# Altium schematic sheet Sheet2.SchDoc
size A4
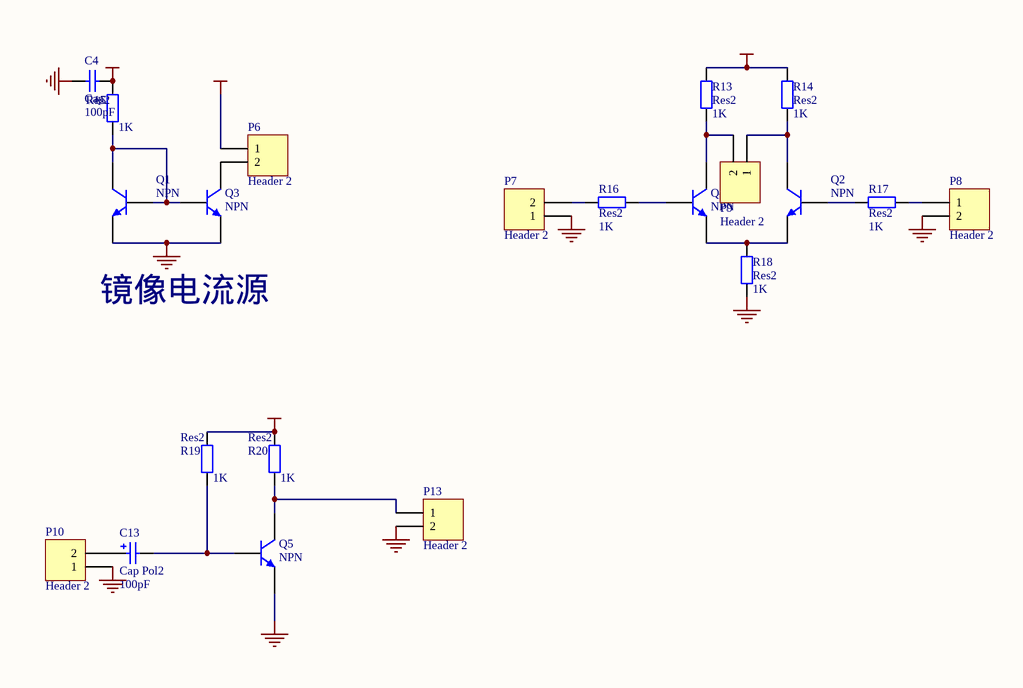
[diagram p0: Sheet2.SchDoc]

## Parts
C4  Cap  value 100pF  [6-0805]
C13  Cap Pol2  value 100pF  [3.2X1.6X1.1]
P6  Header 2  [HDR1X2]
P7  Header 2  [HDR1X2]
P8  Header 2  [HDR1X2]
P9  Header 2  [HDR1X2]
P10  Header 2  [HDR1X2]
P13  Header 2  [HDR1X2]
Q1  NPN  [TO-226]
Q2  NPN  [TO-226]
Q3  NPN  [TO-226]
Q4  NPN  [TO-226]
Q5  NPN  [TO-226]
R13  Res2  value 1K  [6-0805]
R14  Res2  value 1K  [6-0805]
R15  Res2  value 1K  [6-0805]
R16  Res2  value 1K  [6-0805]
R17  Res2  value 1K  [6-0805]
R18  Res2  value 1K  [6-0805]
R19  Res2  value 1K  [6-0805]
R20  Res2  value 1K  [6-0805]

## Nets
+12: C4.2 P6.1 R13.1 R14.1 R15.2 R19.2 R20.2
GND: C4.1 P7.1 P8.2 P10.1 P13.2 Q1.3(E) Q3.3(E) Q5.3(E) R18.2
NetC13_1: C13.1 P10.2
NetC13_2: C13.2 Q5.2(B) R19.1
NetP6_2: P6.2 Q3.1(C)
NetP7_2: P7.2 R16.2
NetP8_1: P8.1 R17.1
NetP9_1: P9.1 Q2.1(C) R14.2
NetP9_2: P9.2 Q4.1(C) R13.2
NetP13_1: P13.1 Q5.1(C) R20.1
NetQ1_1: Q1.1(C) Q1.2(B) Q3.2(B) R15.1
NetQ2_2: Q2.2(B) R17.2
NetQ2_3: Q2.3(E) Q4.3(E) R18.1
NetQ4_2: Q4.2(B) R16.1

## Notes on the sheet
- 镜像电流源

## Library data of the parts
C4 = Cap: Capacitor; Published: 8-Jun-2000; LatestRevisionDate: 17-Jul-2002; LatestRevisionNote: Re-released for DXP Platform.; PackageReference: RAD-0.3; Publisher: Altium Limited
C13 = Cap Pol2: Polarized Capacitor (Axial); Published: 8-Jun-2000; LatestRevisionDate: 17-Jul-2002; LatestRevisionNote: Re-released for DXP Platform.; PackageReference: POLAR0.8; Publisher: Altium Limited
P6-P10 P13 = Header 2: Header, 2-Pin; LatestRevisionDate: 17-Jul-2002; LatestRevisionNote: Re-released for DXP Platform.; Publisher: Altium Limited
Q1-Q5 = NPN: NPN Bipolar Transistor; Published: 8-Jun-2000; LatestRevisionDate: 17-Jul-2002; LatestRevisionNote: Re-released for DXP Platform.; PackageReference: TO-226; Publisher: Altium Limited; Code_JEDEC: TO-226-AA
R13-R20 = Res2: Resistor; Published: 8-Jun-2000; LatestRevisionDate: 17-Jul-2002; LatestRevisionNote: Re-released for DXP Platform.; PackageReference: AXIAL-0.4; Publisher: Altium Limited